# Altium schematic sheet 无线遥控器.SchDoc
size A3
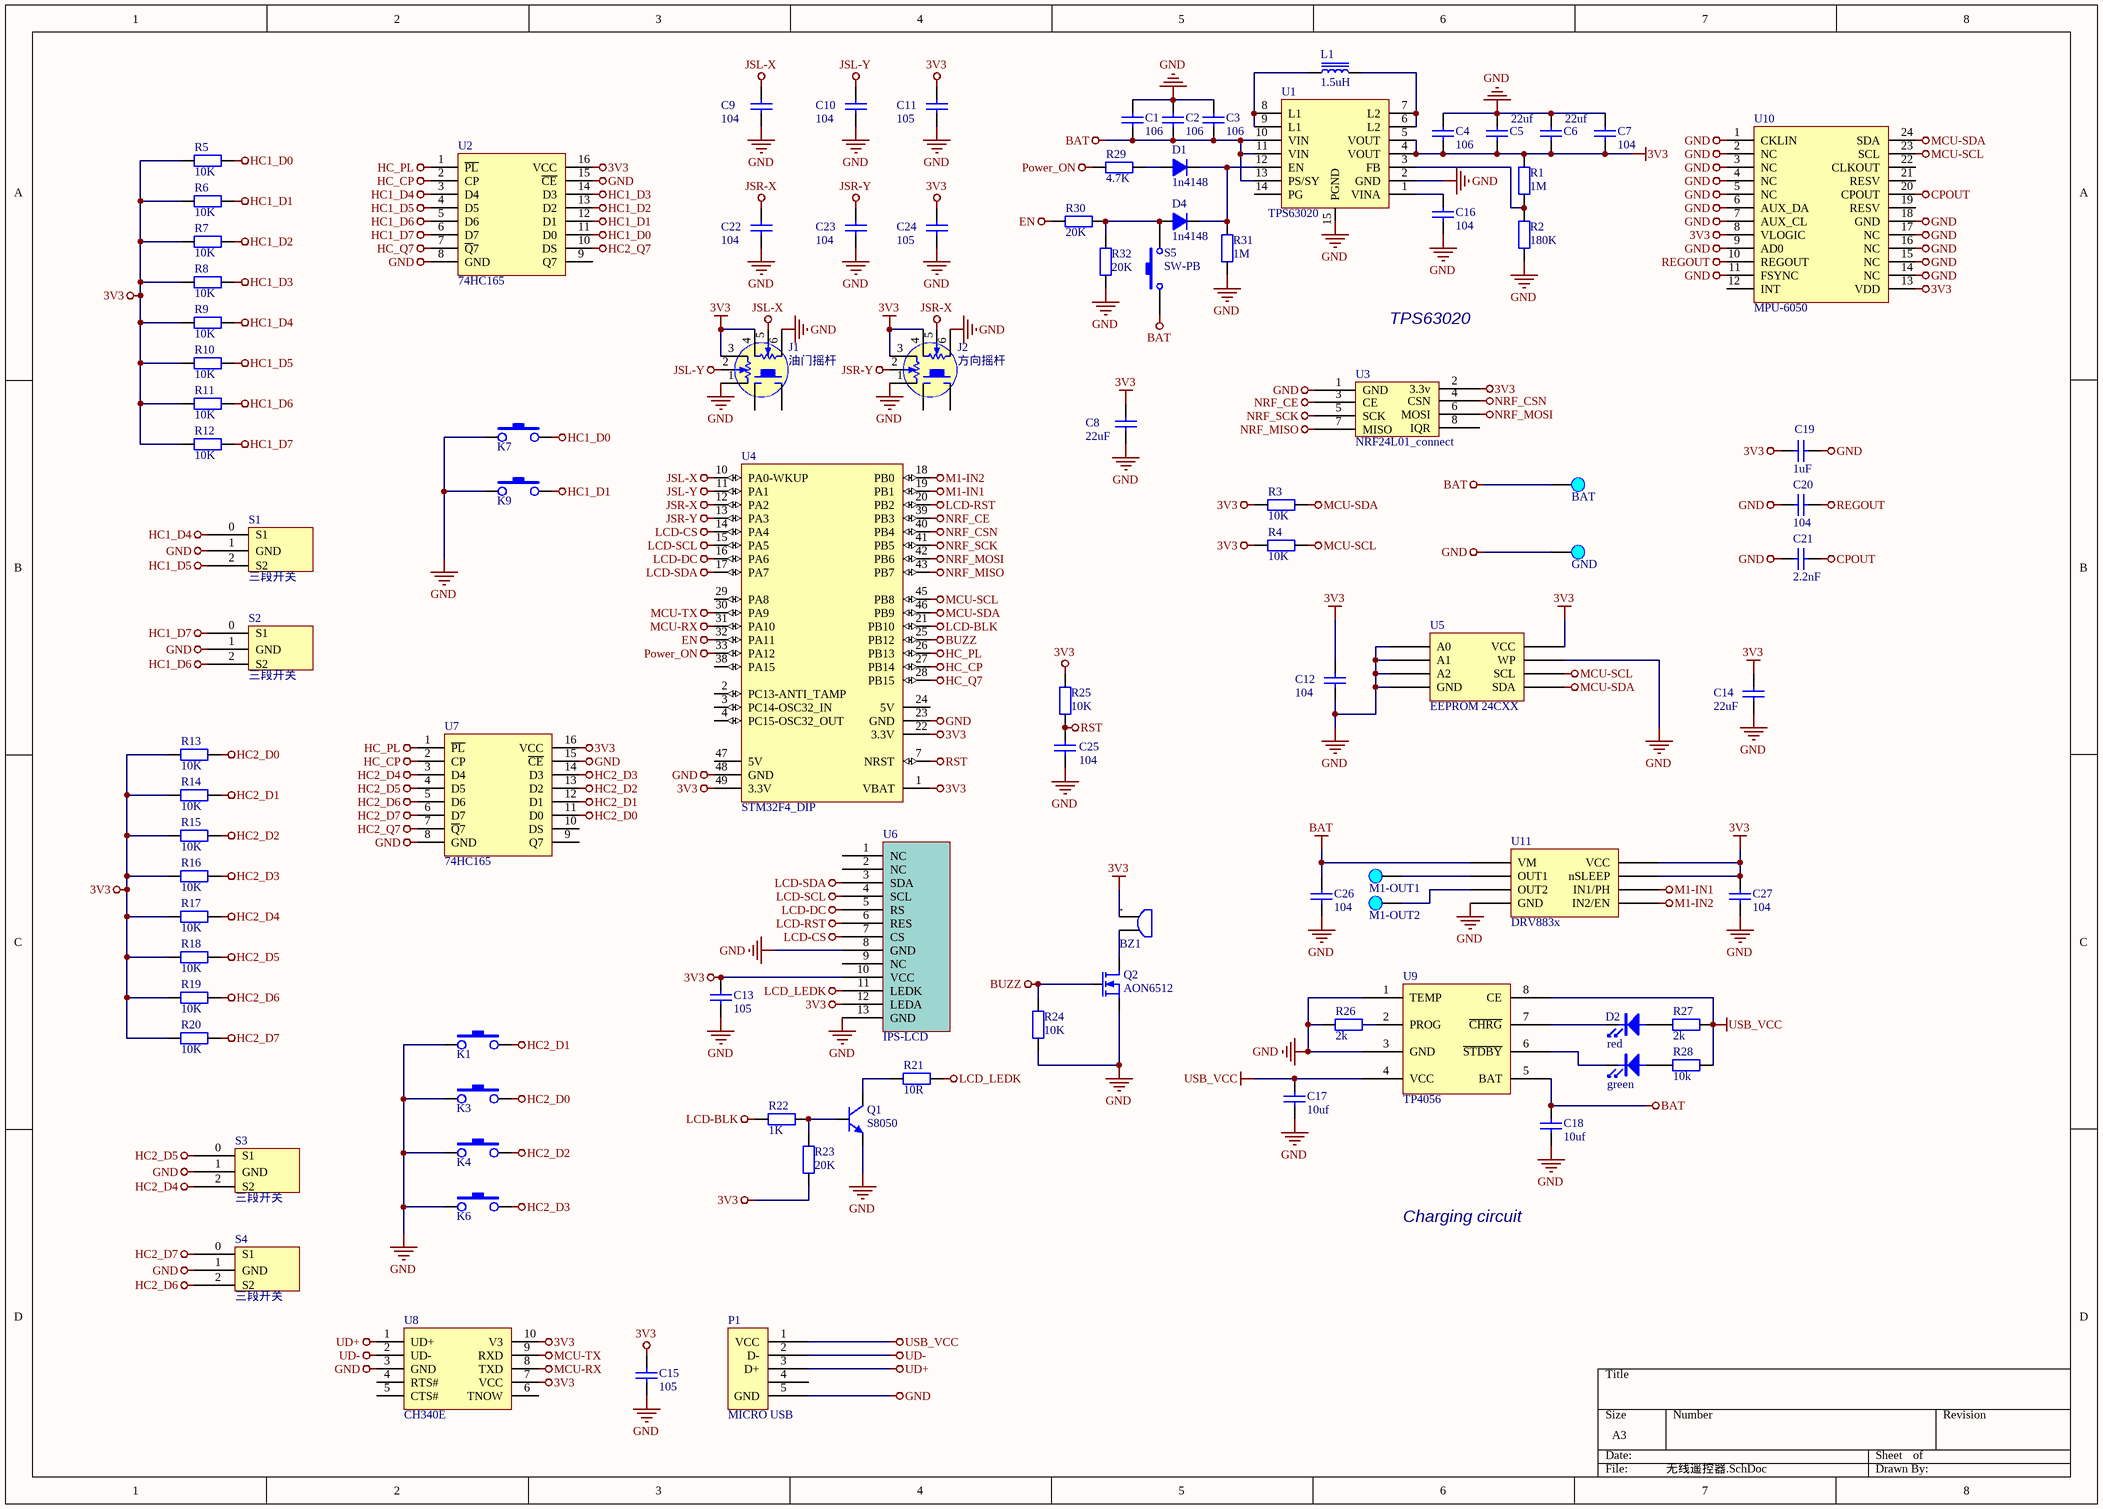
[diagram p0: 无线遥控器.SchDoc]

## Parts
BAT  BAT  [Pad_B]
BZ1  蜂鸣器  [BUZZ-DIP]  (value not drawn)
C1  106  [电容_C0603]
C2  106  [电容_C0603]
C3  106  [电容_C0603]
C4  106  [电容_C0603]
C5  22uf  [电容_C1206]
C6  22uf  [电容_C1206]
C7  104  [电容_C0603]
C8  22uF  [电容_C1206]
C9  104  [电容_C0603]
C10  104  [电容_C0603]
C11  105  [电容_C0603]
C12  104  [电容_C0603]
C13  105  [电容_C0603]
C14  22uF  [电容_C1206]
C15  105  [电容_C0603]
C16  104  [电容_C0603]
C17  10uf  [电容_C0603]
C18  10uf  [电容_C0603]
C19  1uF  [电容_C0603]
C20  104  [电容_C0603]
C21  2.2nF  [电容_C0603]
C22  104  [电容_C0603]
C23  104  [电容_C0603]
C24  105  [电容_C0603]
C25  104  [电容_C0603]
C26  104  [电容_C0603]
C27  104  [电容_C0603]
D1  1n4148  [LED_0603]
D2  red  [LED_0603]
D3  green  [LED_0603]
D4  1n4148  [LED_0603]
GND  GND  [Pad_B]
J1  油门摇杆  [摇杆2]
J2  方向摇杆  [摇杆2]
K1  SKRP  [KEY_M]  (value not drawn)
K3  SKRP  [KEY_M]  (value not drawn)
K4  SKRP  [KEY_M]  (value not drawn)
K6  SKRP  [KEY_M]  (value not drawn)
K7  SKRP  [KEY_M]  (value not drawn)
K9  SKRP  [KEY_M]  (value not drawn)
L1  1.5uH  [变压器电感_0420]
M1  M1-OUT1  [Pad_B]
M2  M1-OUT2  [Pad_B]
P1  MICRO USB  [接插件_MICRO 牛角插座 USB 卷边]
Q1  S8050  [三极管_SOT-23]
Q2  AON6512  [三极管_SOT-23]
R1  1M  [电阻_R0603]
R2  180K  [电阻_R0603]
R3  10K  [电阻_R0603]
R4  10K  [电阻_R0603]
R5  10K  [电阻_R0603]
R6  10K  [电阻_R0603]
R7  10K  [电阻_R0603]
R8  10K  [电阻_R0603]
R9  10K  [电阻_R0603]
R10  10K  [电阻_R0603]
R11  10K  [电阻_R0603]
R12  10K  [电阻_R0603]
R13  10K  [电阻_R0603]
R14  10K  [电阻_R0603]
R15  10K  [电阻_R0603]
R16  10K  [电阻_R0603]
R17  10K  [电阻_R0603]
R18  10K  [电阻_R0603]
R19  10K  [电阻_R0603]
R20  10K  [电阻_R0603]
R21  10R  [电阻_R0603]
R22  1K  [电阻_R0603]
R23  20K  [电阻_R0603]
R24  10K  [电阻_R0603]
R25  10K  [电阻_R0603]
R26  2k  [电阻_R0603]
R27  2k  [电阻_R0603]
R28  R: 10k  [电阻_R0603]  (hidden comment: 2k)
R29  4.7K  [电阻_R0603]
R30  20K  [电阻_R0603]
R31  1M  [电阻_R0603]
R32  20K  [电阻_R0603]
S1  三段开关  [三段开关]
S2  三段开关  [三段开关]
S3  三段开关  [三段开关]
S4  三段开关  [三段开关]
S5  SW-PB  [KEY_M]
U1  TPS63020  [TPS63020]
U2  74HC165  [74HC系列_SOP16]
U3  NRF24L01_connect  [NRF24L01_connect]
U4  STM32F4_DIP  [STM32_DIP]
U5  EEPROM 24CXX  [SOP8]
U6  IPS-LCD  [1.14IPS-LCD]
U7  74HC165  [74HC系列_SOP16]
U8  CH340E  [串口_MSOP10]
U9  TP4056  [SOP-8_PAD]
U10  MPU-6050  [陀螺仪_QFN24]
U11  DRV883x  [WSON-8]

## Nets
3V3: BZ1.1 C4.1 C5.1 C6.1 C7.1 C8.2 C11.2 C12.2 C13.2 C14.2 C15.2 C19.2 C24.2 C27.2 J1.3 J1.4 J2.3 J2.4 R1.1 R3.2 R4.2 R5.1 R6.1 R7.1 R8.1 R9.1 R10.1 R11.1 R12.1 R13.1 R14.1 R15.1 R16.1 R17.1 R18.1 R19.1 R20.1 R23.1 R25.2 U1.4(VOUT) U1.5(VOUT) U2.16(VCC) U3.2(3.3v) U4.1(VBAT) U4.22(3.3V) U4.49(3.3V) U5.8(VCC) U6.10(VCC) U6.12(LEDA) U7.16(VCC) U8.7(VCC) U8.10(V3) U10.8(VLOGIC) U10.13(VDD) U11.7(nSLEEP) U11.8(VCC)
BAT: BAT.1 C1.1 C2.1 C3.1 C18.2 C26.1 S5.1 U1.10(VIN) U1.11(VIN) U1.13(PS/SY) U9.5(BAT) U11.1(VM)
BUZZ: Q2.1(G) R24.2 U4.25(PB12)
CPOUT: C21.1 U10.20(CPOUT)
EN: R30.2 U4.32(PA11)
GND: C1.2 C2.2 C3.2 C4.2 C5.2 C6.2 C7.2 C8.1 C9.1 C10.1 C11.1 C12.1 C13.1 C14.1 C15.1 C16.1 C17.1 C18.1 C19.1 C20.2 C21.2 C22.1 C23.1 C24.1 C25.1 C26.2 C27.1 GND.1 J1.1 J1.6 J2.1 J2.6 K1.1 K3.1 K4.1 K6.1 K7.1 K9.1 P1.0 P1.5(GND) Q1.3(E) Q2.3(S) R2.2 R24.1 R26.1 R31.1 R32.2 S1.1(GND) S2.1(GND) S3.1(GND) S4.1(GND) U1.2(GND) U1.15(PGND) U2.8(GND) U2.15(~{CE}) U3.1(GND) U4.23(GND) U4.48(GND) U5.1(A0) U5.2(A1) U5.3(A2) U5.4(GND) U5.7(WP) U6.8(GND) U6.13(GND) U7.8(GND) U7.15(~{CE}) U8.3(GND) U9.0(GND) U9.1(TEMP) U9.3(GND) U10.1(CKLIN) U10.2(NC) U10.3(NC) U10.4(NC) U10.5(NC) U10.6(AUX_DA) U10.7(AUX_CL) U10.9(AD0) U10.11(FSYNC) U10.14(NC) U10.15(NC) U10.16(NC) U10.17(NC) U10.18(GND) U11.4(GND)
HC1_D0: K7.2 R5.2 U2.11(D0)
HC1_D1: K9.2 R6.2 U2.12(D1)
HC1_D2: R7.2 U2.13(D2)
HC1_D3: R8.2 U2.14(D3)
HC1_D4: R9.2 S1.0(S1) U2.3(D4)
HC1_D5: R10.2 S1.2(S2) U2.4(D5)
HC1_D6: R11.2 S2.2(S2) U2.5(D6)
HC1_D7: R12.2 S2.0(S1) U2.6(D7)
HC2_D0: K3.2 R13.2 U7.11(D0)
HC2_D1: K1.2 R14.2 U7.12(D1)
HC2_D2: K4.2 R15.2 U7.13(D2)
HC2_D3: K6.2 R16.2 U7.14(D3)
HC2_D4: R17.2 S3.2(S2) U7.3(D4)
HC2_D5: R18.2 S3.0(S1) U7.4(D5)
HC2_D6: R19.2 S4.2(S2) U7.5(D6)
HC2_D7: R20.2 S4.0(S1) U7.6(D7)
HC2_Q7: U2.10(DS) U7.7(~{Q}7)
HC_CP: U2.2(CP) U4.27(PB14) U7.2(CP)
HC_PL: U2.1(~{PL}) U4.26(PB13) U7.1(~{PL})
HC_Q7: U2.7(~{Q}7) U4.28(PB15)
JSL-X: C9.2 J1.5 U4.10(PA0-WKUP)
JSL-Y: C10.2 J1.2 U4.11(PA1)
JSR-X: C22.2 J2.5 U4.12(PA2)
JSR-Y: C23.2 J2.2 U4.13(PA3)
LCD-BLK: R22.1 U4.21(PB10)
LCD-CS: U4.14(PA4) U6.7(CS)
LCD-DC: U4.16(PA6) U6.5(RS)
LCD-RST: U4.20(PB2) U6.6(RES)
LCD-SCL: U4.15(PA5) U6.4(SCL)
LCD-SDA: U4.17(PA7) U6.3(SDA)
LCD_LEDK: R21.2 U6.11(LEDK)
M1-IN1: U4.19(PB1) U11.6(IN1/PH)
M1-IN2: U4.18(PB0) U11.5(IN2/EN)
MCU-RX: U4.31(PA10) U8.8(TXD)
MCU-SCL: R4.1 U4.45(PB8) U5.6(SCL) U10.23(SCL)
MCU-SDA: R3.1 U4.46(PB9) U5.5(SDA) U10.24(SDA)
MCU-TX: U4.30(PA9) U8.9(RXD)
NRF_CE: U3.3(CE) U4.39(PB3)
NRF_CSN: U3.4(CSN) U4.40(PB4)
NRF_MISO: U3.7(MISO) U4.43(PB7)
NRF_MOSI: U3.6(MOSI) U4.42(PB6)
NRF_SCK: U3.5(SCK) U4.41(PB5)
Power_ON: R29.2 U4.33(PA12)
REGOUT: C20.1 U10.10(REGOUT)
RST: C25.2 R25.1 U4.7(NRST)
UD+: P1.3(D+) U8.1(UD+)
UD-: P1.2(D-) U8.2(UD-)
USB_VCC: C17.2 P1.1(VCC) R27.2 R28.2 U9.4(VCC) U9.8(CE)
NetBZ1_2: BZ1.2 Q2.2(D)
NetC16_2: C16.2 U1.1(VINA)
NetD1_A: D1.A R29.1
NetD1_K: D1.K D4.K R31.2 U1.12(EN)
NetD2_A: D2.A R27.1
NetD2_K: D2.K U9.7(~{CHRG})
NetD3_A: D3.A R28.1
NetD3_K: D3.K U9.6(~{STDBY})
NetD4_A: D4.A R30.1 R32.1 S5.2
NetL1_1: L1.1 U1.8(L1) U1.9(L1)
NetL1_2: L1.2 U1.6(L2) U1.7(L2)
NetM1_1: M1.1 U11.2(OUT1)
NetM2_1: M2.1 U11.3(OUT2)
NetQ1_1: Q1.1(B) R22.2 R23.2
NetQ1_2: Q1.2(C) R21.1
NetR1_2: R1.2 R2.1 U1.3(FB)
NetR26_2: R26.2 U9.2(PROG)

Not connected (* = marked no-connect by the designer): J1 J1 J2; J2 J1 J2; P1 4; U1 14(PG); U2 9(Q7); U3 8(IQR); U4 2(PC13-ANTI_TAMP) 3(PC14-OSC32_IN) 4(PC15-OSC32_OUT) 24(5V) 29(PA8) 38(PA15) 47(5V); U6 1(NC) 2(NC) 9(NC); U7 9(Q7) 10(DS); U8 4(RTS#) 5(CTS#) 6(TNOW); U10 0 12(INT) 19(RESV) 21(RESV) 22(CLKOUT)

## Notes on the sheet
- TPS63020
- Charging circuit
- (in symbol BZ) +

## Library data of the parts
BAT = Pad: _Funcyusa: Test; _Specification: Pad,Test,BAT; _Comma: ,; _Name: Pad; _Remarks: BAT
BZ1 = BZ
C1-C27 = cap: U: 50V; 参数: Cap,0805,X7R,104K,50V,125C,±10%
  C1-C4: C: 106
  C5 C6: C: 22uf
  C7 C9 C10 C12 C16 C20 C22 C23 C25-C27: C: 104
  C8 C14: C: 22uF
  C11 C13 C15 C24: C: 105
  C17 C18: C: 10uf
  C19: C: 1uF
  C21: C: 2.2nF
D1 D4 = Diode: Default Diode; Published: 8-Jun-2000; LatestRevisionDate: 17-Jul-2002; LatestRevisionNote: Re-released for DXP Platform.; PackageVersion: Sep-1996; PackageReference: SMC; Publisher: Altium Limited; PackageDescription: DO-214-AB/SMC; 2 C-Bend Leads; Body 7.9 x 5.9 mm, inc. leads (LxW); Code_JEDEC: DO-214-AB
D2 D3 = LED: 参数: LED,0603,Red
GND = Pad: _Funcyusa: Test; _Specification: Pad,Test,GND; _Comma: ,; _Name: Pad; _Remarks: GND
J1 = 摇杆
J2 = 摇杆_1: 摇杆
K1 K3 K4 K6 K7 K9 = SW-PB: _Comma: ,; _Name: KEY; _Specification: KEY,SKRP,*; _Footprint: *; _Model: SKRP
L1 = Inductor Iron 2: _Current: 10A; _Accuracy: 20%; _Footprint: 1040; _Name: IND; _Specification: IND,1040,1.5uH,10A,20%; _Comma: ,; _Value: 1.5uH
M1 = Pad: _Funcyusa: Test; _Specification: Pad,Test,M1-OUT1; _Comma: ,; _Name: Pad; _Remarks: M1-OUT1
M2 = Pad: _Funcyusa: Test; _Specification: Pad,Test,M1-OUT2; _Comma: ,; _Name: Pad; _Remarks: M1-OUT2
P1 = MICRO USB 5PIN: _Comma: ,; _Name: Port; _Specification: Port,MICRO USB,5PIN; _Value: 5PIN; _Model: MICRO USB
Q1 = Triode-NPN: _Comma: ,; _Current: 500mA; _Footprint: SOT-23; _Name: Triode; _Specification: Triode,NPN,S8050,SOT-23,500mA,40V; _Voltage: 40V; _Polarity: NPN; _Model: S8050
Q2 = MOSFET-N: 参数: N-MOSFET,DFN5*6,AON6512,30V,150A
R1-R20 R24-R32 = Res: P: 1/8W; 参数: Res,0805,0R,±1%,1/8W,100ppm,155C
  R1 R31: R: 1M
  R2: R: 180K
  R3-R20 R24 R25: R: 10K
  R26 R27: R: 2k
  R29: R: 4.7K
  R30 R32: R: 20K
R21 = Res: _Accuracy: 1%; _Power: 1/8W; _Footprint: 0805; _Drift: 100ppm; _Comma: ,; _Specification: Res,0805,10R,1%,1/8W,100ppm; _Name: Res; _Value: 10R
R22 = Res: _Accuracy: 1%; _Power: 1/8W; _Footprint: 0805; _Drift: 100ppm; _Comma: ,; _Specification: Res,0805,1K,1%,1/8W,100ppm; _Name: Res; _Value: 1K
R23 = Res: _Accuracy: 1%; _Power: 1/8W; _Footprint: 0805; _Drift: 100ppm; _Comma: ,; _Specification: Res,0805,20K,1%,1/8W,100ppm; _Name: Res; _Value: 20K
S5 = SW-PB: 按键
U4 = STM32F401CCU6_1: DIP; Manufacturer: STMicroelectronics; Core: ARM Cortex-M4; FLASH Size (Prog) (kB): 256; I/Os (High Current): 36; Internal RAM Size (kB): 64; Operating Frequency(F) (Processor speed) (MHz): 84; Packing: Tray; Supply Voltage(Vcc) max (V): 3.6; Supply Voltage(Vcc) min (V): 1.8; DatasheetVersion: Rev. 1; PackageVersion: Rev. 1, 04/2013; PackageReference: UFQFPN48; PackageDescription: 48-Pin Ultra Thin Fine Pitch Quad Flat No-Lead, 7 x 7 x 0.6 mm Body, 0.5 mm Pitch, Exposed Pad; Supplier 1: Newark; Supplier Part Number 1: 19X6217; Supplier 2: Mouser; Supplier Part Number 2: 511-STM32F401CCU6; Mounting Technology: Surface Mount; PartNumber: STM32F401CCU6; ComponentLink1Description: Manufacturer URL; ComponentLink1URL: http://www.st.com/web/en/home.html; ComponentLink2Description: Datasheet; ComponentLink2URL: http://www.st.com/st-web-ui/static/active/en/resource/technical/document/data_brief/DM00071938.pdf; ComponentLink3Description: Package Specification; ComponentLink3URL: http://www.st.com/st-web-ui/static/active/en/resource/technical/document/data_brief/DM00071938.pdf
U5 = EEPROM 24CXX: 24CXX
U6 = IPS-LCD-1.14: IPS-LCD-1.14寸裸屏spi接口
U8 = CH340E: _Comma: ,; _Footprint: MSOP10; _Name: USB-UART; _Specification: USB-UART,CH340E,MSOP10; _Model: CH340E
U9 = TP4056: 参数: Charge Control,LP4056,ESOP-8